# Altium schematic sheet Nav_Solenoid_IO.SchDoc
size A
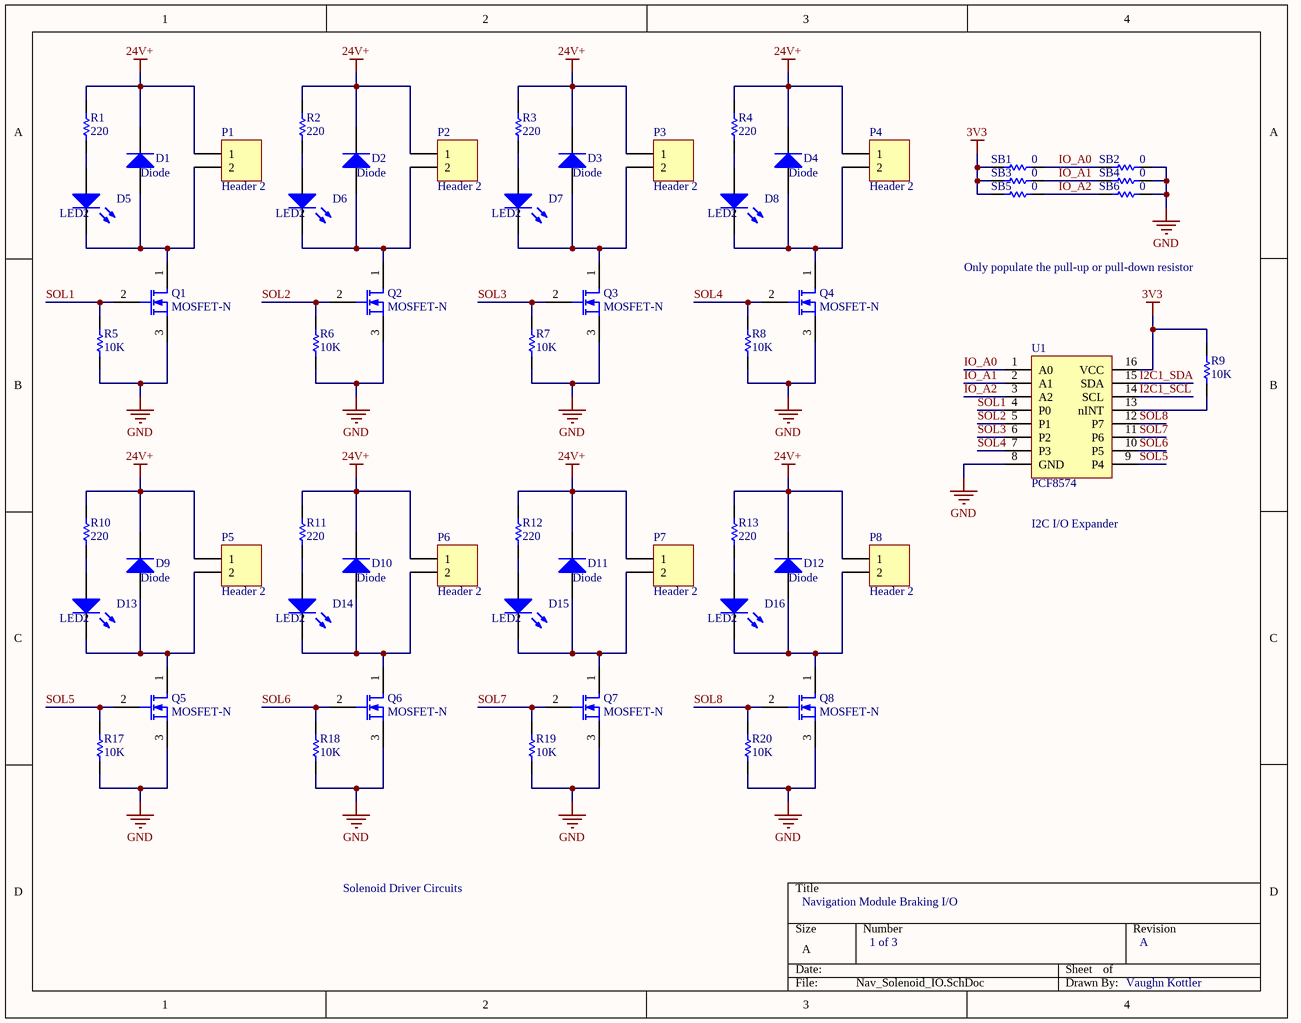
[diagram p0: Nav_Solenoid_IO.SchDoc]

## Parts
D1  Diode  [DIODE_SMC]
D2  Diode  [DIODE_SMC]
D3  Diode  [DIODE_SMC]
D4  Diode  [DIODE_SMC]
D5  LED2  [3.2X1.6X1.1]
D6  LED2  [3.2X1.6X1.1]
D7  LED2  [3.2X1.6X1.1]
D8  LED2  [3.2X1.6X1.1]
D9  Diode  [DIODE_SMC]
D10  Diode  [DIODE_SMC]
D11  Diode  [DIODE_SMC]
D12  Diode  [DIODE_SMC]
D13  LED2  [3.2X1.6X1.1]
D14  LED2  [3.2X1.6X1.1]
D15  LED2  [3.2X1.6X1.1]
D16  LED2  [3.2X1.6X1.1]
P1  Header 2  [2POS TERM BLOCK]
P2  Header 2  [2POS TERM BLOCK]
P3  Header 2  [2POS TERM BLOCK]
P4  Header 2  [2POS TERM BLOCK]
P5  Header 2  [2POS TERM BLOCK]
P6  Header 2  [2POS TERM BLOCK]
P7  Header 2  [2POS TERM BLOCK]
P8  Header 2  [2POS TERM BLOCK]
Q1  MOSFET-N  [SOT23_N]
Q2  MOSFET-N  [SOT23_N]
Q3  MOSFET-N  [SOT23_N]
Q4  MOSFET-N  [SOT23_N]
Q5  MOSFET-N  [SOT23_N]
Q6  MOSFET-N  [SOT23_N]
Q7  MOSFET-N  [SOT23_N]
Q8  MOSFET-N  [SOT23_N]
R1  value 220  [6-0805_M]  (hidden comment: Res1)
R2  value 220  [6-0805_M]  (hidden comment: Res1)
R3  value 220  [6-0805_M]  (hidden comment: Res1)
R4  value 220  [6-0805_M]  (hidden comment: Res1)
R5  value 10K  [6-0805_M]  (hidden comment: Res1)
R6  value 10K  [6-0805_M]  (hidden comment: Res1)
R7  value 10K  [6-0805_M]  (hidden comment: Res1)
R8  value 10K  [6-0805_M]  (hidden comment: Res1)
R9  value 10K  [6-0805_M]  (hidden comment: Res1)
R10  value 220  [6-0805_M]  (hidden comment: Res1)
R11  value 220  [6-0805_M]  (hidden comment: Res1)
R12  value 220  [6-0805_M]  (hidden comment: Res1)
R13  value 220  [6-0805_M]  (hidden comment: Res1)
R17  value 10K  [6-0805_M]  (hidden comment: Res1)
R18  value 10K  [6-0805_M]  (hidden comment: Res1)
R19  value 10K  [6-0805_M]  (hidden comment: Res1)
R20  value 10K  [6-0805_M]  (hidden comment: Res1)
SB1  value 0  [6-0805_M]  (hidden comment: Res1)
SB2  value 0  [6-0805_M]  (hidden comment: Res1)
SB3  value 0  [6-0805_M]  (hidden comment: Res1)
SB4  value 0  [6-0805_M]  (hidden comment: Res1)
SB5  value 0  [6-0805_M]  (hidden comment: Res1)
SB6  value 0  [6-0805_M]  (hidden comment: Res1)
U1  PCF8574  [16-SOIC]

## Nets
3V3: R9.2 SB1.2 SB3.2 SB5.2 U1.16(VCC)
24V+: D1.2(K) D2.2(K) D3.2(K) D4.2(K) D9.2(K) D10.2(K) D11.2(K) D12.2(K) P1.1 P2.1 P3.1 P4.1 P5.1 P6.1 P7.1 P8.1 R1.2 R2.2 R3.2 R4.2 R10.2 R11.2 R12.2 R13.2
GND: Q1.3(S) Q2.3(S) Q3.3(S) Q4.3(S) Q5.3(S) Q6.3(S) Q7.3(S) Q8.3(S) R5.1 R6.1 R7.1 R8.1 R17.1 R18.1 R19.1 R20.1 SB2.1 SB4.1 SB6.1 U1.8(GND)
I2C1_SCL: U1.14(SCL)
I2C1_SDA: U1.15(SDA)
IO_A0: SB1.1 SB2.2 U1.1(A0)
IO_A1: SB3.1 SB4.2 U1.2(A1)
IO_A2: SB5.1 SB6.2 U1.3(A2)
SOL1: Q1.2(G) R5.2 U1.4(P0)
SOL2: Q2.2(G) R6.2 U1.5(P1)
SOL3: Q3.2(G) R7.2 U1.6(P2)
SOL4: Q4.2(G) R8.2 U1.7(P3)
SOL5: Q5.2(G) R17.2 U1.9(P4)
SOL6: Q6.2(G) R18.2 U1.10(P5)
SOL7: Q7.2(G) R19.2 U1.11(P6)
SOL8: Q8.2(G) R20.2 U1.12(P7)
NetD1_1: D1.1(A) D5.2(K) P1.2 Q1.1(D)
NetD2_1: D2.1(A) D6.2(K) P2.2 Q2.1(D)
NetD3_1: D3.1(A) D7.2(K) P3.2 Q3.1(D)
NetD4_1: D4.1(A) D8.2(K) P4.2 Q4.1(D)
NetD5_1: D5.1(A) R1.1
NetD6_1: D6.1(A) R2.1
NetD7_1: D7.1(A) R3.1
NetD8_1: D8.1(A) R4.1
NetD9_1: D9.1(A) D13.2(K) P5.2 Q5.1(D)
NetD10_1: D10.1(A) D14.2(K) P6.2 Q6.1(D)
NetD11_1: D11.1(A) D15.2(K) P7.2 Q7.1(D)
NetD12_1: D12.1(A) D16.2(K) P8.2 Q8.1(D)
NetD13_1: D13.1(A) R10.1
NetD14_1: D14.1(A) R11.1
NetD15_1: D15.1(A) R12.1
NetD16_1: D16.1(A) R13.1
NetR9_1: R9.1 U1.13(nINT)

## Notes on the sheet
- Only populate the pull-up or pull-down resistor
- I2C I/O Expander
- Solenoid Driver Circuits
- Navigation Module Braking I/O
- 1 of 3
- A
- Vaughn Kottler

## Library data of the parts
D1-D4 D9-D12 = Diode: Default Diode; Published: 8-Jun-2000; LatestRevisionDate: 17-Jul-2002; LatestRevisionNote: Re-released for DXP Platform.; PackageVersion: Sep-1996; PackageReference: SMC; Publisher: Altium Limited; PackageDescription: DO-214-AB/SMC; 2 C-Bend Leads; Body 7.9 x 5.9 mm, inc. leads (LxW); Code_JEDEC: DO-214-AB
D5-D8 D13-D16 = LED2: Typical RED, GREEN, YELLOW, AMBER GaAs LED; Published: 8-Jun-2000; LatestRevisionDate: 17-Jul-2002; LatestRevisionNote: Re-released for DXP Platform.; PackageVersion: Feb-2002; PackageReference: 3.2X1.6X1.1; Publisher: Altium Limited; PackageDescription: SM LED; 2 Flat Leads
P1-P8 = Header 2: Header, 2-Pin; LatestRevisionDate: 17-Jul-2002; LatestRevisionNote: Re-released for DXP Platform.; Publisher: Altium Limited
Q1-Q8 = MOSFET-N: N-Channel MOSFET; pin to pad: 2>3 3>2; Published: 8-Jun-2000; LatestRevisionDate: 17-Jul-2002; LatestRevisionNote: Re-released for DXP Platform.; PackageVersion: 1995/1996; PackageReference: E3; Publisher: Altium Limited; PackageDescription: TO, Flat Index; 3 In-Line, Axial Leads; Body Dia. 4.6mm; Lead Dia. 0.5 mm (max)
R1-R13 R17-R20 SB1-SB6 = Res1: Resistor; Published: 8-Jun-2000; LatestRevisionDate: 17-Jul-2002; LatestRevisionNote: Re-released for DXP Platform.; PackageReference: AXIAL-0.3; Publisher: Altium Limited; PackageDescription: Axial Device, Thru-Hole; 2 Leads; 0.3 in Pin Spacing
U1 = PCF8574: I2C I/O Expander; ComponentLink1Description: Part; ComponentLink1URL: https://www.digikey.com/product-detail/en/texas-instruments/PCF8574DWR/296-13108-1-ND/484579; ComponentLink2Description: Datasheet; ComponentLink2URL: http://www.ti.com/lit/ds/symlink/pcf8574.pdf